# EAGLE design rfDuinoBO (EAGLE 6.4)
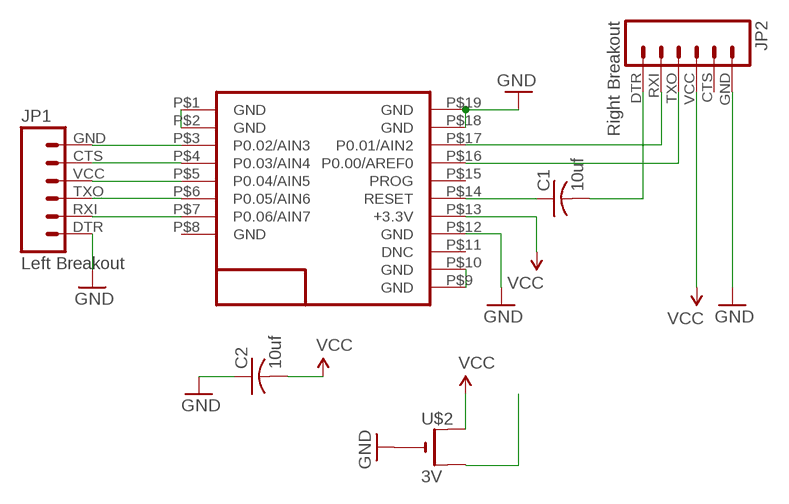
[diagram p0: schematic, sheet 1]

## Parts
C1  10uf  C-USC0603  [C0603]
C2  10uf  C-USC0603  [C0603]
JP1  Left Breakout  M06SIP  [1X06]
JP2  Right Breakout  M06SIP  [1X06]
U$1  RFD22301  [RFD21733]
U$2  3V  CR2032THM  [CR2032-THRU]

## Nets
GND: C2.1 JP1.DTR JP2.GND U$1.P$12(GND) U$1.P$18(GND) U$1.P$19(GND) U$2.-
N$1: U$2.+2(+1)
N$4: U$1.P$9(GND) U$1.P$10(GND)
N$5: U$1.P$1(GND) U$1.P$2(GND)
N$6: C1.1 U$1.P$14(RESET)
N$7: C1.2 JP2.DTR
N$8: JP2.RXI U$1.P$17(P0.01/AIN2)
N$9: JP2.TXO U$1.P$16(P0.00/AREF0)
P2: JP1.GND U$1.P$3(P0.02/AIN3)
P3: JP1.CTS U$1.P$4(P0.03/AIN4)
P4: JP1.VCC U$1.P$5(P0.04/AIN5)
P5: JP1.TXO U$1.P$6(P0.05/AIN6)
P6: JP1.RXI U$1.P$7(P0.06/AIN7)
VCC: C2.2 JP2.VCC U$1.P$13(+3.3V) U$2.+1(+)
Unconnected: JP2.CTS U$1.P$8(GND) U$1.P$11(DNC) U$1.P$15(PROG)

## Library data of the parts
C1 C2 = adafruit:C-US: CAPACITOR, American symbol
JP1 JP2 = SparkFun-Connectors:M06: Header 6 Standard 6-pin 0.1" header. Use with straight break away headers (SKU : PRT-00116), right angle break away headers (PRT-00553), swiss pins (PRT-00743), machine pins (PRT-00117), and female headers (PRT-00115). Molex polarized connector foot print use with SKU : PRT-08094 with associated crimp pins and housings. NOTES ON THE VARIANTS LOCK and LOCK_LONGPADS... This footprint was designed to help hold the alignment of a through-hole component (i.e. 6-pin header) while soldering it into place. You may notice that each hole has been shifted either up or down by 0.005 of an inch from it's more standard position (which is a perfectly straight line). This slight alteration caused the pins (the squares in the middle) to touch the edges of the holes. Because they are alternating, it causes a "brace" to hold the component in place. 0.005 has proven to be the perfect amount of "off-center" position when using our standard breakaway headers. Although looks a little odd when you look at the bare footprint, once you have a header in there, the alteration is very hard to notice. Also,if you push a header all the way into place, it is covered up entirely on the bottom side. This idea of altering the position of holes to aid alignment will be further integrated into the Sparkfun Library for other footprints. It can help hold any component with 3 or more connection pins.
U$1 = RFD22301-11.25.13:RFD22301: RF Digital RFD22301
U$2 = adafruit:CR2032

## Board
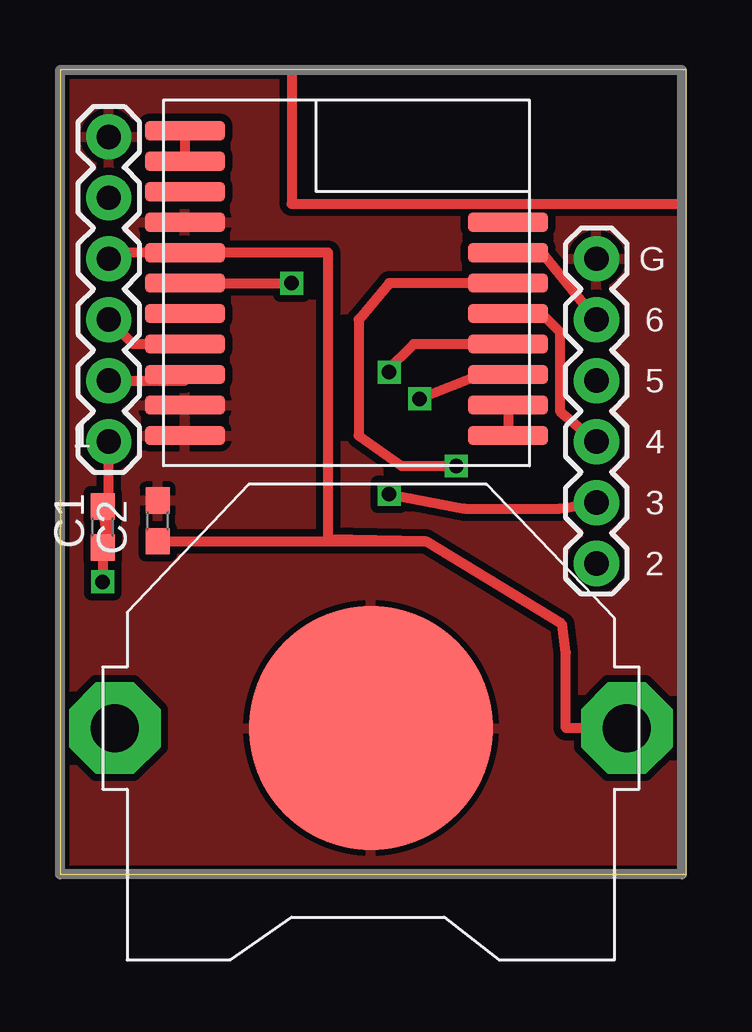
[diagram p1: board, top side]
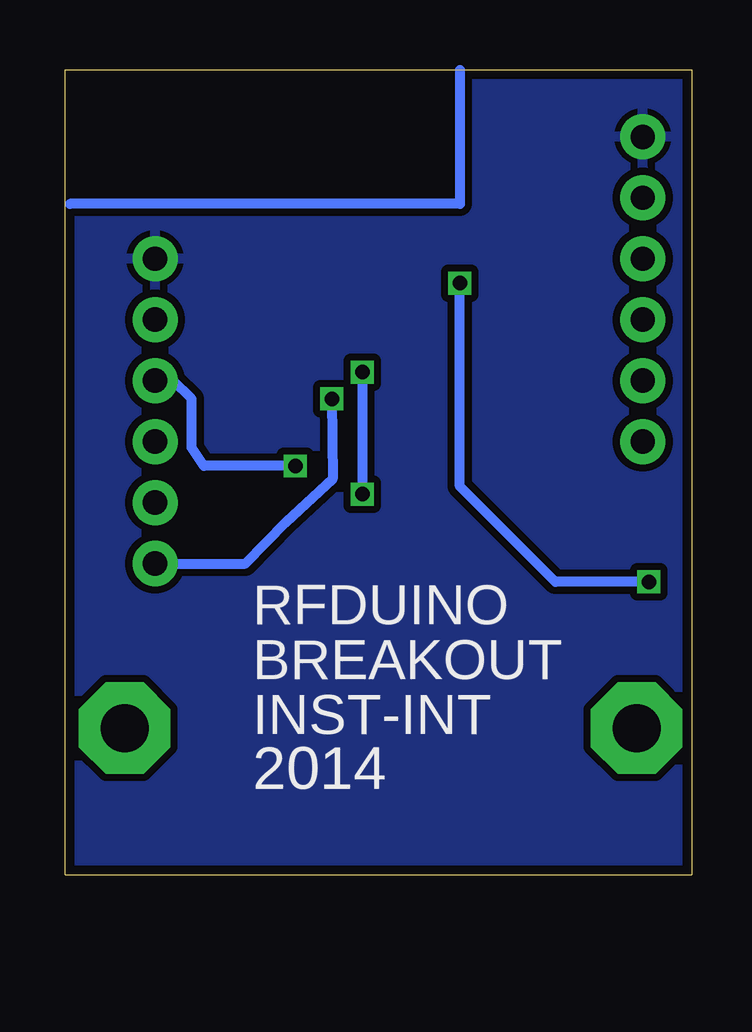
[diagram p2: board, bottom side, seen from below]

Size 26.09 x 33.53 mm. Coordinates in mm from the lower left corner, seen from the top.
Outline: 26.09,0 26.09,33.53 0,33.53 0,0 26.09,0
Copper layers (1*16): Top 0.0356mm / dielectric 1.5011mm / Bottom 0.0356mm
Design rules "LaenPCBOrder": minimum track width 6mil, minimum drill 13mil, track to track 6mil, track to pad 6mil, pad to pad 6mil, via to via 6mil, smd to smd 6mil, copper to edge 15mil, drill to drill 6mil, minimum pad ring 7mil, minimum via ring 7mil, stop-mask expansion 3mil, vias tented up to drill 0mil, thermal gap 10mil

### Footprints (pad centres in the part's own frame; a part is rotated, then mirrored left to right if it is on the bottom)
C0603 = smd 1.1 x 1: 1 -0.85,0; 2 0.85,0
1X06 = drill 1.016 pad 1.88: CTS 10.16,0; DTR 0,0; GND 12.7,0; RXI 2.54,0; TXO 5.08,0; VCC 7.62,0
RFD21733 = smd 3.353 x 0.813: P$1 -6.731,6.35; P$2 -6.731,5.08; P$3 -6.731,3.81; P$4 -6.731,2.54; P$5 -6.731,1.27; P$6 -6.731,0; P$7 -6.731,-1.27; P$8 -6.731,-2.54; P$9 6.731,-6.35; P$10 6.731,-5.08; P$11 6.731,-3.81; P$12 6.731,-2.54; P$13 6.731,-1.27; P$14 6.731,0; P$15 6.731,1.27; P$16 6.731,2.54; P$17 6.731,3.81; P$18 6.731,5.08; P$19 6.731,6.35
CR2032-THRU = drill 2 pad 3.81 octagon: +1 -10.668,0; +2 10.668,0 | smd 10.16 x 10.16: - 0,0

### Placement (x,y rotation side)
C1  1.78,14.49 90 top
C2  4.06,14.74 270 top
JP1  22.35,25.66 270 top
JP2  2.03,18.04 90 top
U$1  11.94,24.65 180 top
U$2  12.95,6.11 180 top

### Tracks (layer width: path | path; a pad name or v marks a point on that pad's centre or on a via)
GND
  pour Top (isolate 0.305): 0,33.54 25.91,33.54 25.91,0.01 0,0.01
  pour Bottom (isolate 0.305): 0,33.54 25.91,33.54 25.91,0.01 0,0.01
N$2
  Top 0.406: 9.65,33.54 9.65,27.95 25.91,27.95
N$3
  Bottom 0.406: 9.65,33.54 9.65,27.95 25.91,27.95
N$4
  Top 0.406: U$1.P$9 U$1.P$10
N$5
  Top 0.406: 18.8,19.57 U$1.P$2 U$1.P$1
N$6  (via drill 0.6)
  Top 0.406: U$1.P$14 v9.65,24.65 | C1.1 v1.78,12.2
  Bottom 0.406: v1.78,12.2 5.68,12.2 9.65,16.18 v9.65,24.65
N$7
  Top 0.406: C1.2 2.03,13.31 JP2.DTR
N$8
  Top 0.406: JP2.RXI 5.21,20.58 U$1.P$17
N$9
  Top 0.406: U$1.P$16 3.05,22.11 JP2.TXO
P2  (via drill 0.6)
  Top 0.406: U$1.P$3 17.53,20.84 v14.99,19.82
  Bottom 0.406: v14.99,19.82 14.95,16.49 16.9,14.68 18.59,12.96 JP1.GND
P3  (via drill 0.6)
  Top 0.406: U$1.P$4 14.73,22.11 13.56,20.94 v13.72,20.94 | v13.72,15.86 16.86,15.25 20.83,15.25 JP1.CTS
  Bottom 0.406: v13.72,20.94 v13.72,15.86
P4
  Top 0.406: U$1.P$5 20.07,23.38 20.83,22.62 20.83,19.31 JP1.VCC
P5  (via drill 0.6)
  Top 0.406: U$1.P$6 13.72,24.65 12.45,23.12 12.45,18.3 14.22,17.03 v16.51,17.03
  Bottom 0.406: v16.51,17.03 20.32,17.03 20.83,17.79 20.83,19.82 21.59,20.58 JP1.TXO
P6
  Top 0.406: U$1.P$7 20.07,25.92 JP1.RXI
VCC
  Top 0.406: JP2.VCC 2.03,25.92 U$1.P$13 11.18,25.92 11.18,13.98 15.24,13.89 | C2.2 15.24,13.89 | U$2.+1 21.08,6.11 21.08,9.25 20.92,10.42 15.24,13.89

### Text on the board
tPlace: G | 6 | 5 | 1 | 4 | 3 | 2
bPlace: RFDUINO | BREAKOUT | INST-INT | 2014